# Altium schematic sheet 1_P1.schdoc
size 314 x 314 mm; Symbol: Drawing-Symbol_A4; Device: Drawing-Symbol_A4; @Project Name: AudioDeck; @Page Count: 1; @Update Date: 2026-05-13; @Create Date: 2026-05-13; @Schematic Name: Schematic 1.2; @Page No: 1; @Page Name: Schematic 1.2; Company: EasyEDA.com; Version: V1.0; Page Size: A4; @Create Time: 15:41:03; @Update Time: 10:41:33; Width: 1200; Height: 1200; Region Start: 1; X Region Count: 6; Y Region Count: 4; Blade Width: 10; Title Block Position: 3; @Board Name: Prototype 1.2
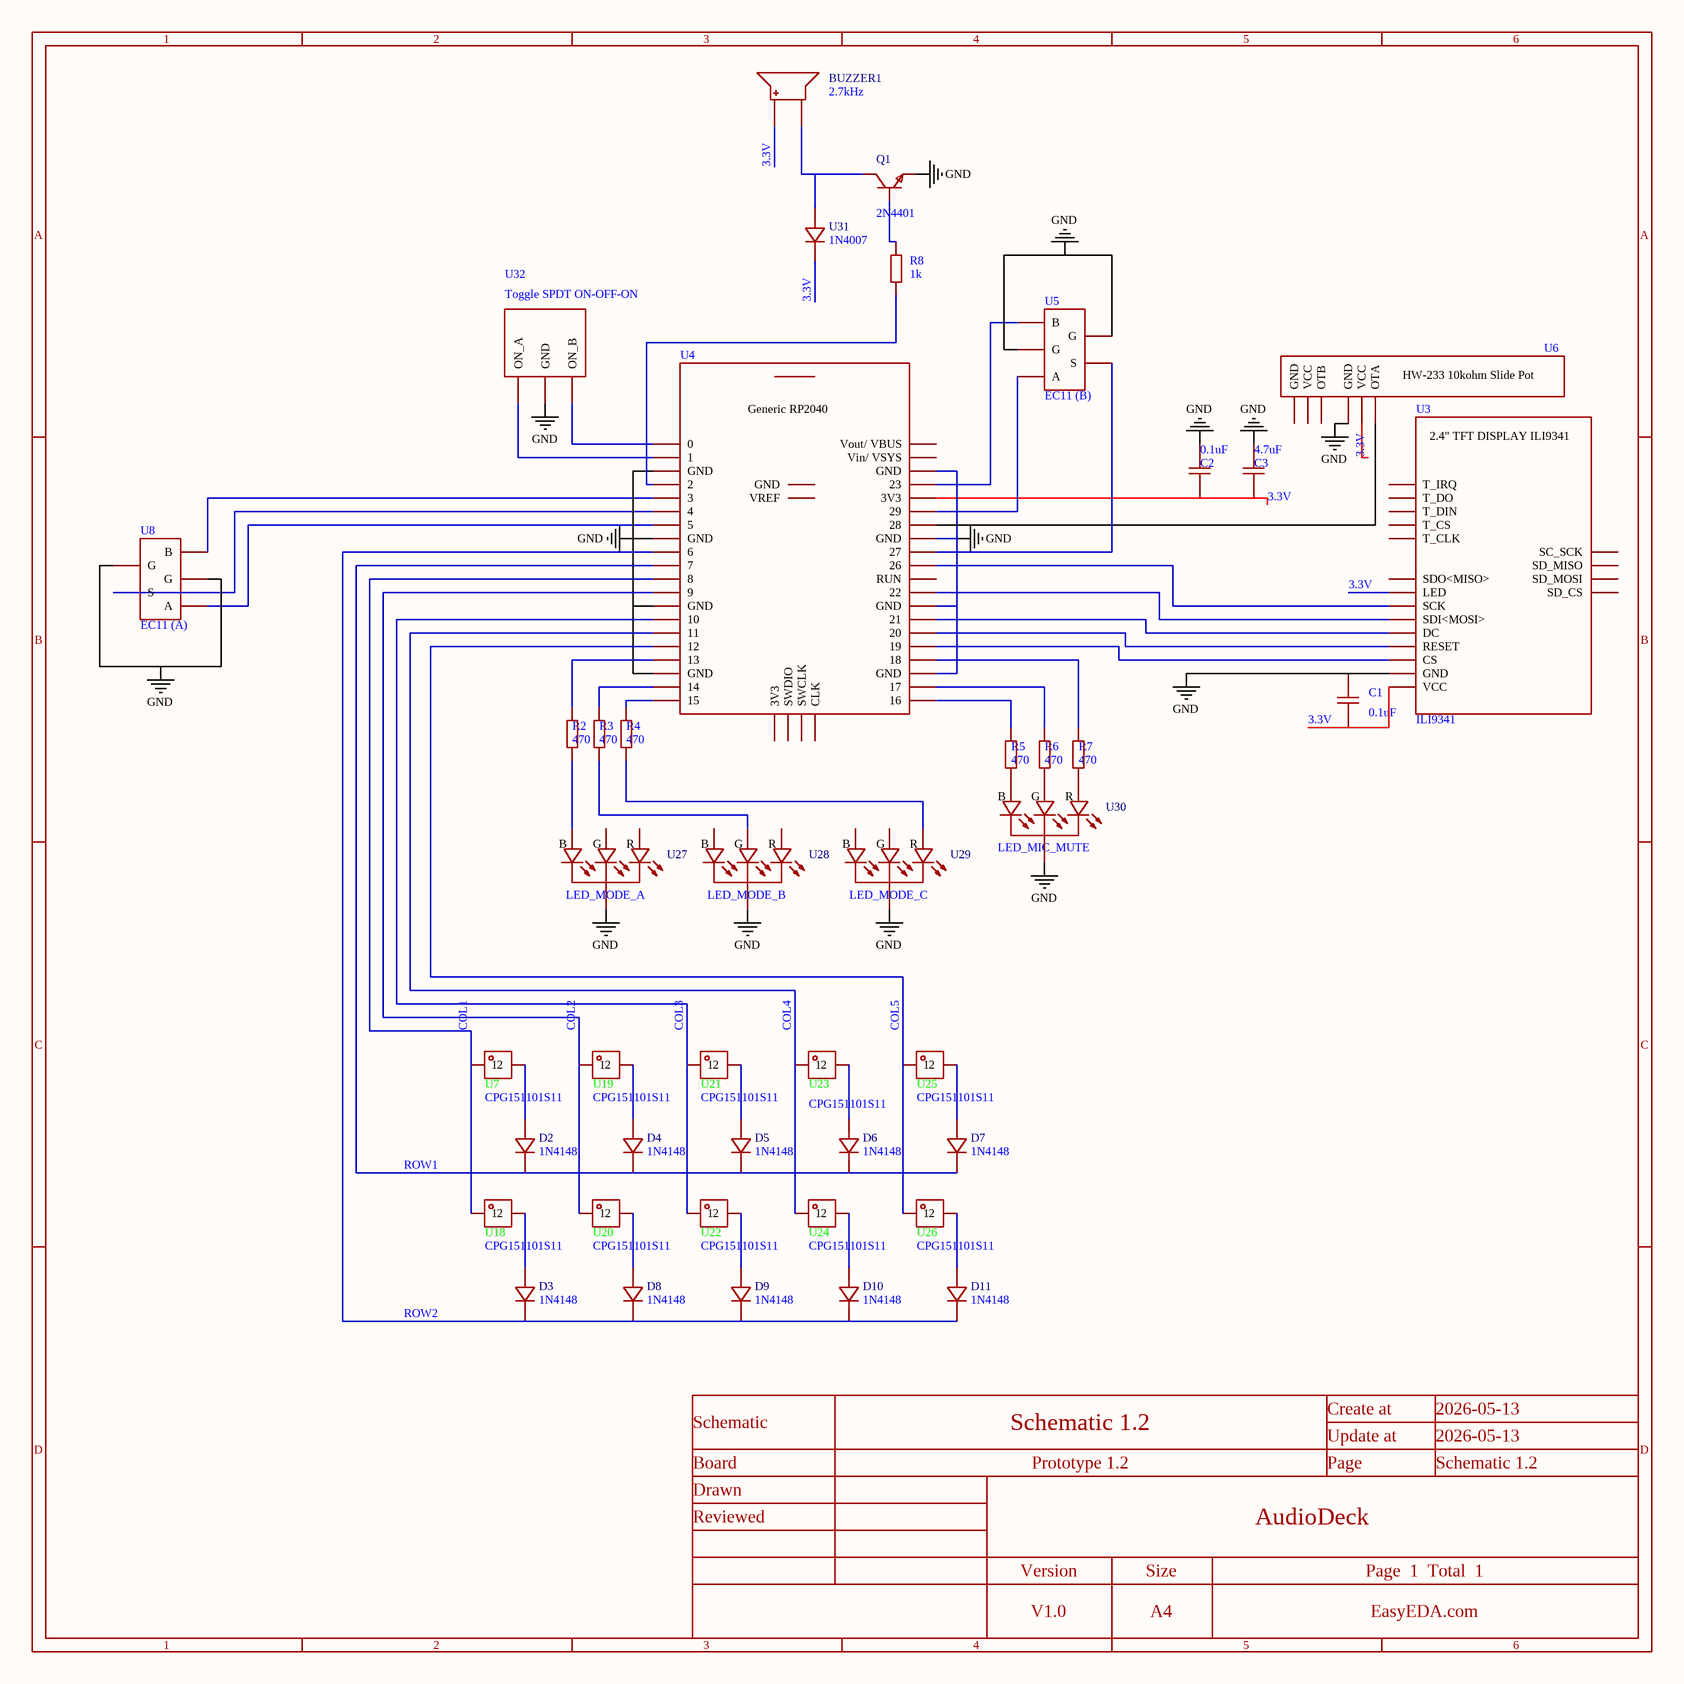
[diagram p0: 1_P1.schdoc]

## Parts
BUZZER1  2.7kHz  [BUZ-TH_BD9.0-P4.00-D0.6-FD]
C1  0.1uF  [C0603]
C2  0.1uF  [C0603]
C3  4.7uF  [C0603]
D2  1N4148  [DO-35_BD1.7-L3.6-P10.00-D0.5-RD]
D3  1N4148  [DO-35_BD1.7-L3.6-P10.00-D0.5-RD]
D4  1N4148  [DO-35_BD1.7-L3.6-P10.00-D0.5-RD]
D5  1N4148  [DO-35_BD1.7-L3.6-P10.00-D0.5-RD]
D6  1N4148  [DO-35_BD1.7-L3.6-P10.00-D0.5-RD]
D7  1N4148  [DO-35_BD1.7-L3.6-P10.00-D0.5-RD]
D8  1N4148  [DO-35_BD1.7-L3.6-P10.00-D0.5-RD]
D9  1N4148  [DO-35_BD1.7-L3.6-P10.00-D0.5-RD]
D10  1N4148  [DO-35_BD1.7-L3.6-P10.00-D0.5-RD]
D11  1N4148  [DO-35_BD1.7-L3.6-P10.00-D0.5-RD]
Q1  2N4401  [TO-92-3_L4.9-W3.7-P1.27-L]
R2  470  [R0603]
R3  470  [R0603]
R4  470  [R0603]
R5  470  [R0603]
R6  470  [R0603]
R7  470  [R0603]
R8  1k  [R0603]
U3  ILI9341
U4  (no value)
U5  EC11 (B)
U6  (no value)
U7  CPG151101S11  [TH_L11.0-W5.9-KS-2P02B01-01]
U8  EC11 (A)
U18  CPG151101S11  [TH_L11.0-W5.9-KS-2P02B01-01]
U19  CPG151101S11  [TH_L11.0-W5.9-KS-2P02B01-01]
U20  CPG151101S11  [TH_L11.0-W5.9-KS-2P02B01-01]
U21  CPG151101S11  [TH_L11.0-W5.9-KS-2P02B01-01]
U22  CPG151101S11  [TH_L11.0-W5.9-KS-2P02B01-01]
U23  CPG151101S11  [TH_L11.0-W5.9-KS-2P02B01-01]
U24  CPG151101S11  [TH_L11.0-W5.9-KS-2P02B01-01]
U25  CPG151101S11  [TH_L11.0-W5.9-KS-2P02B01-01]
U26  CPG151101S11  [TH_L11.0-W5.9-KS-2P02B01-01]
U27  LED_MODE_A  [LED-TH_4P-BD5.8-P1.27]
U28  LED_MODE_B  [LED-TH_4P-BD5.8-P1.27]
U29  LED_MODE_C  [LED-TH_4P-BD5.8-P1.27]
U30  LED_MIC_MUTE  [LED-TH_4P-BD5.8-P1.27]
U31  1N4007  [DO-41_BD2.4-L4.7-P8.70-D0.6-RD]
U32  Toggle SPDT ON-OFF-ON

## Nets
GND: C1.1 C2.1 C3.1 Q1.1(E) U3.2(GND) U4.3(GND) U4.8(GND) U4.13(GND) U4.18(GND) U4.23(GND) U4.28(GND) U4.33(GND) U4.38(GND) U5.1(G) U5.4(G) U6.4(GND) U8.1(G) U8.4(G) U27.2 U28.2 U29.2 U30.2 U32.2(GND)
3.3V: BUZZER1.1 C1.2 C2.2 C3.2 U3.1(VCC) U3.8(LED) U4.25(3V3) U6.5(VCC) U31.1(C)
COL1: U4.11(8) U7.1 U18.1
COL2: U4.12(9) U19.1 U20.1
COL3: U4.14(10) U21.1 U22.1
COL4: U4.15(11) U23.1 U24.1
COL5: U4.16(12) U25.1 U26.1
ROW1: D2.1(C) D4.1(C) D5.1(C) D6.1(C) D7.1(C) U4.10(7)
ROW2: D3.1(C) D8.1(C) D9.1(C) D10.1(C) D11.1(C) U4.9(6)
NetBUZZER1_2: BUZZER1.2 Q1.3(C) U31.2(A)
NetD2_2: D2.2(A) U7.2
NetD3_2: D3.2(A) U18.2
NetD4_2: D4.2(A) U19.2
NetD5_2: D5.2(A) U21.2
NetD6_2: D6.2(A) U23.2
NetD7_2: D7.2(A) U25.2
NetD8_2: D8.2(A) U20.2
NetD9_2: D9.2(A) U22.2
NetD10_2: D10.2(A) U24.2
NetD11_2: D11.2(A) U26.2
NetQ1_2: Q1.2(B) R8.2
NetR2_1: R2.1 U27.4
NetR2_2: R2.2 U4.17(13)
NetR3_1: R3.1 U28.3
NetR3_2: R3.2 U4.19(14)
NetR4_1: R4.1 U29.1
NetR4_2: R4.2 U4.20(15)
NetR5_1: R5.1 U30.4
NetR5_2: R5.2 U4.40(16)
NetR6_1: R6.1 U30.3
NetR6_2: R6.2 U4.39(17)
NetR7_1: R7.1 U30.1
NetR7_2: R7.2 U4.37(18)
NetR8_1: R8.1 U4.4(2)
NetU3_3: U3.3(CS) U4.36(19)
NetU3_4: U3.4(RESET) U4.35(20)
NetU3_5: U3.5(DC) U4.34(21)
NetU3_6: U3.6(SDI<MOSI>) U4.32(22)
NetU3_7: U3.7(SCK) U4.30(26)
NetU4_1: U4.1(0) U32.3(ON_B)
NetU4_2: U4.2(1) U32.1(ON_A)
NetU4_5: U4.5(3) U8.5(B)
NetU4_6: U4.6(4) U8.2(S)
NetU4_7: U4.7(5) U8.3(A)
NetU4_24: U4.24(23) U5.5(B)
NetU4_26: U4.26(29) U5.3(A)
NetU4_27: U4.27(28) U6.6(OTA)
NetU4_29: U4.29(27) U5.2(S)

Not connected (* = marked no-connect by the designer): U3 9(SDO<MISO>) 10(T_CLK) 11(T_CS) 12(T_DIN) 13(T_DO) 14(T_IRQ) 15(SD_CS) 16(SD_MOSI) 17(SD_MISO) 18(SC_SCK); U4 21(Vout/_VBUS) 22(Vin/_VSYS) 31(RUN) 41(GND) 42(VREF) 43(3V3) 44(SWDIO) 45(SWCLK) 46(CLK); U6 1(GND) 2(VCC) 3(OTB); U27 1 3; U28 1 4; U29 3 4

## Notes on the sheet
- (near U30) B
- (near U30) G
- (near U30) R
- (near U27) B
- (near U27) G
- (near U27) R
- (near U28) B
- (near U28) G
- (near U28) R
- (near U29) B
- (near U29) G
- (near U29) R
- 1
- 2
- 3
- 4
- 5
- 6
- A
- C
- Schematic
- Schematic 1.2
- Create at
- Update at
- 2026-05-13
- D
- Board
- Drawn
- Prototype 1.2
- Page
- Reviewed
- Version
- Size
- AudioDeck
- Page  1  Total  1
- V1.0
- A4
- EasyEDA.com
- (in symbol HW-233 10k Slide Pot) HW-233 10kohm Slide Pot
- (in symbol ILI9341) 2.4" TFT DISPLAY ILI9341
- (in symbol RP2040-GENERIC-ALEXP) Generic RP2040

## Library data of the parts
BUZZER1 = QMB-09B-03: Manufacturer: 华能; Add into BOM: yes; Driver Circuitry: Passive (Externally Driven); Voltage - Supply: 2V~5V; Sound Pressure Level(SPL): 85dB; Symbol: QMB-09B-03; Device: QMB-09B-03; LCSC Part Name: 无源蜂鸣器QMB-09B-03; Supplier Part: C96256; Manufacturer Part: QMB-09B-03; Supplier Footprint: 插件,D=9mm; JLCPCB Part Class: Extended Part; Datasheet: https://item.szlcsc.com/datasheet/QMB-09B-03/97460.html; Supplier: LCSC; Convert to PCB: yes; Technology: Electromagnetic; Value: 2.7kHz; Diameter(φD): 9mm; Height: 5.7mm
C1-C3 = CAP_0603: Symbol: CAP; Convert to PCB: yes; Device: CAP_0603; Add into BOM: yes; Supplier Footprint: 0603
  C1 C2: Value: 0.1uF
  C3: Value: 4.7uF
D2-D11 = 1N4148_C22434654: Manufacturer: DIOTEC(德欧泰克); Add into BOM: yes; Pd - Power Dissipation: 500mW; Current - Rectified: 200mA; Voltage - DC Reverse(Vr): 75V; Voltage - Forward(Vf@If): 1V@10mA; Reverse Leakage Current (Ir): 5uA@75V; Operating Junction Temperature Range: -50℃~+175℃; Symbol: 1N4148_C22434654; Device: 1N4148_C22434654; LCSC Part Name: 1N4148; Supplier Part: C22434654; Manufacturer Part: 1N4148; Supplier Footprint: DO-35; JLCPCB Part Class: Extended Part; Datasheet: https://item.szlcsc.com/datasheet/1N4148/24058303.html; Supplier: LCSC; Convert to PCB: yes; Diode Configuration: -; Non-Repetitive Peak Forward Surge Current: -; Reverse Recovery Time (trr): -
Q1 = 2N4401: Manufacturer: ST(先科); Add into BOM: yes; type: NPN; Collector - Emitter Voltage VCEO: 40V; Pd - Power Dissipation: 625mW; DC Current Gain: 100@150mA,1V; Transition frequency(fT): 250MHz; Current - Collector Cutoff: 100nA; Vce Saturation(VCE(sat)): 750mV; Symbol: 2N4401; Device: 2N4401; LCSC Part Name: hfe=40~300; Supplier Part: C118540; Manufacturer Part: 2N4401; Supplier Footprint: TO-92-3; JLCPCB Part Class: Extended Part; Datasheet: https://atta.szlcsc.com/upload/public/pdf/source/20170719/C118540_1500457735787828248.pdf; Supplier: LCSC; Convert to PCB: yes; Operating Temperature: -
R2-R8 = Res_0603: Symbol: Res; Convert to PCB: yes; Device: Res_0603; Add into BOM: yes; Supplier Footprint: 0603
  R2-R7: Value: 470
  R8: Value: 1k
U3 = ILI9341: Add into BOM: yes; Symbol: ILI9341; Device: ILI9341; Convert to PCB: yes
U4 = RP2040-GENERIC-ALEXP: Add into BOM: yes; Symbol: RP2040-GENERIC-ALEXP; Device: RP2040-GENERIC-ALEXP; Convert to PCB: yes
U5 U8 = Generic EC11 encoder: Add into BOM: yes; Symbol: Generic EC11 encoder; Device: Generic EC11 encoder; Convert to PCB: yes
U6 = HW-233 10k Slide Pot: Add into BOM: yes; Symbol: HW-233 10k Slide Pot; Device: HW-233 10k Slide Pot; Convert to PCB: yes
U7 U18-U26 = CPG151101S11: Add into BOM: yes; Symbol: CPG151101S11; Device: CPG151101S11; LCSC Part Name: CPG151101S11; Supplier Part: C9900013508; Manufacturer Part: CPG151101S11; Supplier Footprint: CherryMX_KailhSocket:MXOnly-1U-Hotswap; JLCPCB Part Class: Extended Part; Supplier: LCSC; Convert to PCB: yes
U27-U30 = WP154A4SUREQBFZGC: Manufacturer: Kingbright; Add into BOM: yes; Diode Configuration: Common Cathode; Viewing Angle: 50°; Symbol: WP154A4SUREQBFZGC; Device: WP154A4SUREQBFZGC; LCSC Part Name: WP154A4SUREQBFZGC; Supplier Part: C6751358; Manufacturer Part: WP154A4SUREQBFZGC; Supplier Footprint: 插件,D=5mm; JLCPCB Part Class: Extended Part; Datasheet: https://item.szlcsc.com/datasheet/WP154A4SUREQBFZGC/7709451.html; Supplier: LCSC; Convert to PCB: yes; Lens Color: -
U31 = 1N4007_C5261026: Manufacturer: CJ(江苏长电/长晶); Add into BOM: yes; Voltage - Forward(Vf@If): 1.1V@1A; Voltage - DC Reverse(Vr): 1kV; Current - Rectified: 1A; Reverse Leakage Current (Ir): 5uA@1000V; Non-Repetitive Peak Forward Surge Current: 30A; Operating Junction Temperature Range: -55℃~+150℃; Symbol: 1N4007_C5261026; Device: 1N4007_C5261026; LCSC Part Name: 1kV 1A; Supplier Part: C5261026; Manufacturer Part: 1N4007; Supplier Footprint: DO-41; JLCPCB Part Class: Extended Part; Datasheet: https://item.szlcsc.com/datasheet/1N4007/5983537.html; Supplier: LCSC; Convert to PCB: yes
U32 = SPDT Toggle ON-OFF-ON (3pin): Add into BOM: yes; Symbol: SPDT Toggle ON-OFF-ON (3pin); Device: SPDT Toggle ON-OFF-ON (3pin); Convert to PCB: yes